# EAGLE design WaterCirculation (EAGLE 9.6.2)
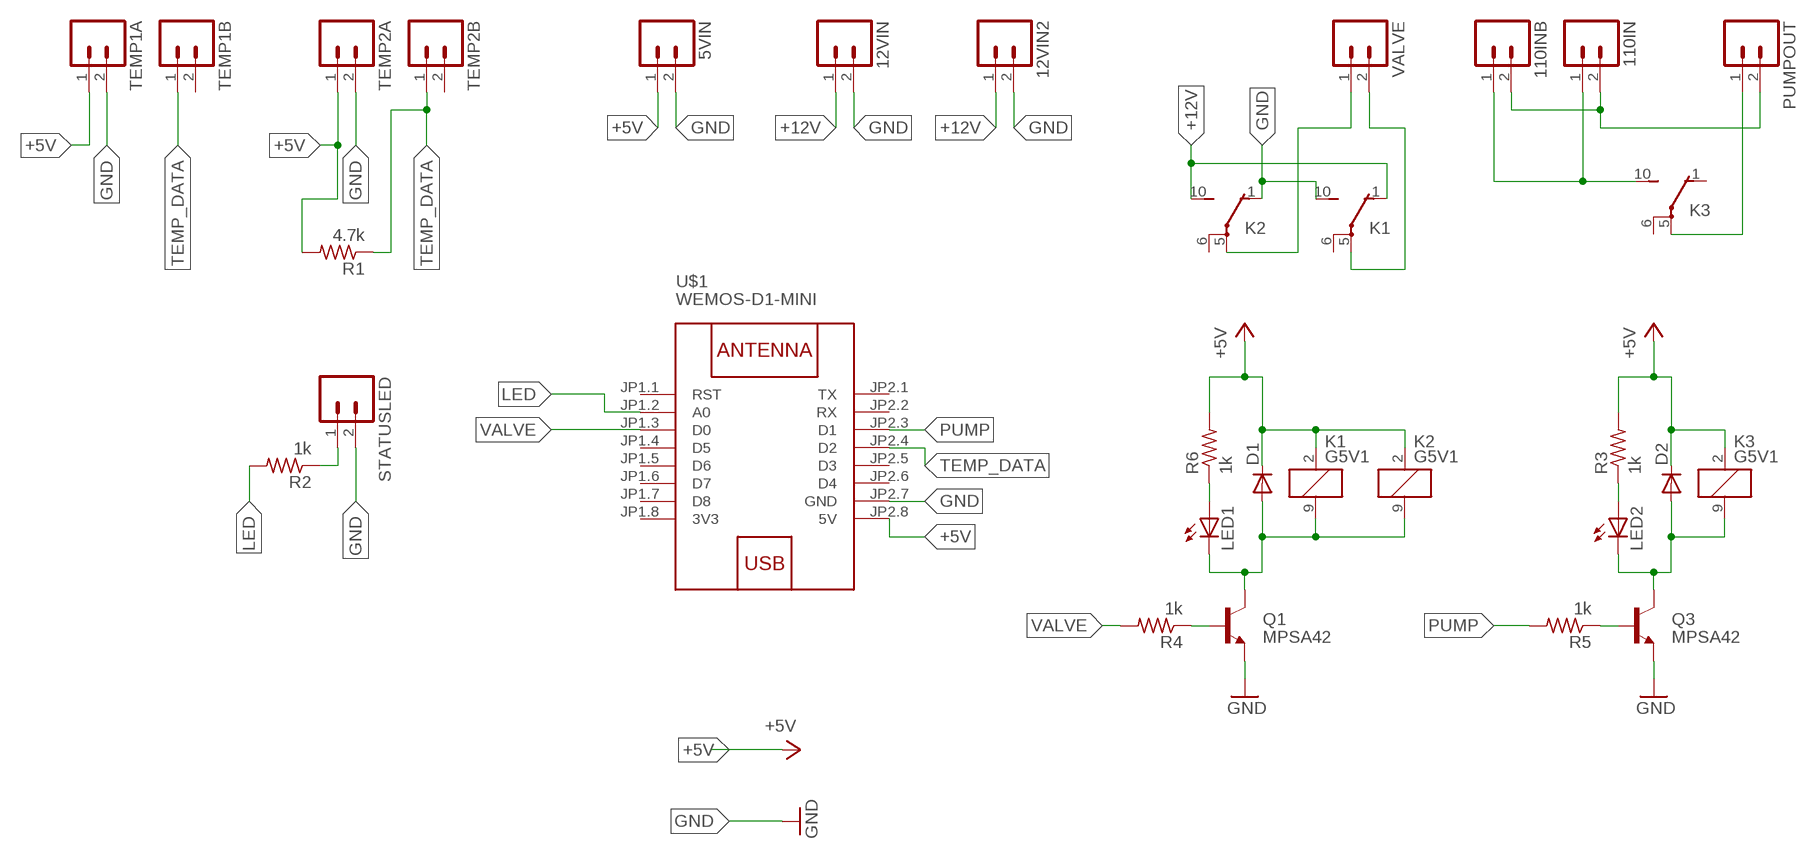
[diagram p0: schematic, sheet 1]

## Parts
5VIN  M023.5MM  [SCREWTERMINAL-3.5MM-2]
12VIN  M023.5MM  [SCREWTERMINAL-3.5MM-2]
12VIN2  M023.5MM  [SCREWTERMINAL-3.5MM-2]
110IN  M023.5MM  [SCREWTERMINAL-3.5MM-2]
110INB  M023.5MM  [SCREWTERMINAL-3.5MM-2]
D1  DIODE-SOD123  [SOD123]
D2  DIODE-SOD123  [SOD123]
K1  G5V1  [G5V1]
K2  G5V1  [G5V1]
K3  G5V1  [G5V1]
LED1  LEDCHIP-LED0805  [CHIP-LED0805]
LED2  LEDCHIP-LED0805  [CHIP-LED0805]
PUMPOUT  M023.5MM  [SCREWTERMINAL-3.5MM-2]
Q1  MPSA42  TRANSISTOR_NPNMPSA42  [SOT23-3]
Q3  MPSA42  TRANSISTOR_NPNMPSA42  [SOT23-3]
R1  4.7k  R-US_R0805  [R0805]
R2  1k  R-US_R0805  [R0805]
R3  1k  R-US_R0805  [R0805]
R4  1k  R-US_R0805  [R0805]
R5  1k  R-US_R0805  [R0805]
R6  1k  R-US_R0805  [R0805]
STATUSLED  M023.5MM  [SCREWTERMINAL-3.5MM-2]
TEMP1A  M023.5MM  [SCREWTERMINAL-3.5MM-2]
TEMP1B  M023.5MM  [SCREWTERMINAL-3.5MM-2]
TEMP2A  M023.5MM  [SCREWTERMINAL-3.5MM-2]
TEMP2B  M023.5MM  [SCREWTERMINAL-3.5MM-2]
U$1  WEMOS-D1-MINI  [WEMOS-D1-MINI]
VALVE  M023.5MM  [SCREWTERMINAL-3.5MM-2]

## Nets
+5V: 5VIN.1 D1.C D2.C K1.2 K2.2 K3.2 R1.2 R3.2 R6.2 TEMP1A.1 TEMP2A.1 U$1.JP2.8(5V)
+12V: 12VIN2.1 12VIN.1 K1.1(2:O) K2.10(2:S)
GND: 5VIN.2 12VIN2.2 12VIN.2 K1.10(2:S) K2.1(2:O) Q1.2(E) Q3.2(E) STATUSLED.2 TEMP1A.2 TEMP2A.2 U$1.JP2.7(GND)
LED: R2.2 U$1.JP1.2(A0)
N$1: Q1.1(B) R4.1
N$2: D1.A K1.9 K2.9 LED1.C Q1.3(C)
N$3: LED1.A R6.1
N$4: K2.5(2:P) VALVE.1
N$5: K1.5(2:P) VALVE.2
N$6: 110IN.2 110INB.2 PUMPOUT.2
N$7: D2.A K3.9 LED2.C Q3.3(C)
N$8: LED2.A R3.1
N$9: Q3.1(B) R5.1
N$10: 110IN.1 110INB.1 K3.10(2:S)
N$11: K3.5(2:P) PUMPOUT.1
N$12: R2.1 STATUSLED.1
PUMP: R5.2 U$1.JP2.3(D1)
TEMP_DATA: R1.1 TEMP1B.1 TEMP2B.1 U$1.JP2.4(D2)
VALVE: R4.2 U$1.JP1.3(D0)
Unconnected: K1.6(2:P) K2.6(2:P) K3.1(2:O) K3.6(2:P) TEMP1B.2 TEMP2B.2 U$1.JP1.1(RST) U$1.JP1.4(D5) U$1.JP1.5(D6) U$1.JP1.6(D7) U$1.JP1.7(D8) U$1.JP2.1(TX) U$1.JP2.2(RX) U$1.JP2.5(D3) U$1.JP2.6(D4)

## Power pins joined to a net without a drawn wire
3V3: U$1.JP1.8(3V3)

## Library data of the parts
5VIN 12VIN 12VIN2 110IN 110INB PUMPOUT STATUSLED TEMP1A TEMP1B TEMP2A TEMP2B VALVE = SparkFun-Connectors:M02: Standard 2-pin 0.1" header. Use with - straight break away headers ( PRT-00116) - right angle break away headers (PRT-00553) - swiss pins (PRT-00743) - machine pins (PRT-00117) - female headers (PRT-00115) Molex polarized connector foot print use with: PRT-08233 with associated crimp pins and housings. 2.54_SCREWTERM for use with PRT-10571. 3.5mm Screw Terminal footprints for PRT-08084 5mm Screw Terminal footprints for use with PRT-08432; PROD_ID: CONN-08399
D1 D2 = diode:DIODE-: DIODE
K1-K3 = relay:G5V1: RELAY 1 x switch, 0.5 A/125 V AC, 1 A/24 V DC , Omron
LED1 LED2 = led:LED: LED OSRAM: - CHIPLED LG R971, LG N971, LY N971, LG Q971, LY Q971, LO R971, LY R971 LH N974, LH R974 LS Q976, LO Q976, LY Q976 LO Q996 - Hyper CHIPLED LW Q18S LB Q993, LB Q99A, LB R99A - SideLED LS A670, LO A670, LY A670, LG A670, LP A670 LB A673, LV A673, LT A673, LW A673 LH A674 LY A675 LS A676, LA A676, LO A676, LY A676, LW A676 LS A679, LY A679, LG A679 - Hyper Micro SIDELED® LS Y876, LA Y876, LO Y876, LY Y876 LT Y87S - SmartLED LW L88C, LW L88S LB L89C, LB L89S, LG L890 LS L89K, LO L89K, LY L89K LS L896, LA L896, LO L896, LY L896 - TOPLED LS T670, LO T670, LY T670, LG T670, LP T670 LSG T670, LSP T670, LSY T670, LOP T670, LYG T670 LG T671, LOG T671, LSG T671 LB T673, LV T673, LT T673, LW T673 LH T674 LS T676, LA T676, LO T676, LY T676, LB T676, LH T676, LSB T676, LW T676 LB T67C, LV T67C, LT T67C, LS T67K, LO T67K, LY T67K, LW E67C LS E67B, LA E67B, LO E67B, LY E67B, LB E67C, LV E67C, LT E67C LW T67C LS T679, LY T679, LG T679 LS T770, LO T770, LY T770, LG T770, LP T770 LB T773, LV T773, LT T773, LW T773 LH T774 LS E675, LA E675, LY E675, LS T675 LS T776, LA T776, LO T776, LY T776, LB T776 LHGB T686 LT T68C, LB T68C - Hyper Mini TOPLED® LB M676 - Mini TOPLED Santana® LG M470 LS M47K, LO M47K, LY M47K Source: http://www.osram.convergy.de LUXEON: - LUMILED® LXK2-PW12-R00, LXK2-PW12-S00, LXK2-PW14-U00, LXK2-PW14-V00 LXK2-PM12-R00, LXK2-PM12-S00, LXK2-PM14-U00 LXK2-PE12-Q00, LXK2-PE12-R00, LXK2-PE12-S00, LXK2-PE14-T00, LXK2-PE14-U00 LXK2-PB12-K00, LXK2-PB12-L00, LXK2-PB12-M00, LXK2-PB14-N00, LXK2-PB14-P00, LXK2-PB14-Q00 LXK2-PR12-L00, LXK2-PR12-M00, LXK2-PR14-Q00, LXK2-PR14-R00 LXK2-PD12-Q00, LXK2-PD12-R00, LXK2-PD12-S00 LXK2-PH12-R00, LXK2-PH12-S00 LXK2-PL12-P00, LXK2-PL12-Q00, LXK2-PL12-R00 Source: www.luxeon.com KINGBRIGHT: KA-3528ASYC Source: www.kingbright.com
Q1 Q3 = SparkFun-DiscreteSemi:TRANSISTOR_NPN: Generic NPN BJT MMBT2222A - TRANS-08049 (SOT-23, 1A 40V) MPSA42 - TRANS-09116 (SOT-23, 500mA 300V) MMBT5088LT1G - TRANS-11160 (SOT-23, 50 mA 30V) BC547 - COM-08928 <http://www.sparkfun.com/products/8928> (TO-92 45V 100mA) (1.Collector 2.Base 3.Emitter) 2N3904 - COM-00521 <http://www.sparkfun.com/products/521> (TO-92 40V 200mA) (1.Emitter 2.Base 3.Collector) P2N2222A - COM-12852 <http://www.sparkfun.com/products/12852> (TO-92 40V 600mA) (1.Collector 2.Base 3.Emitter); PROD_ID: TRANS-09116
R1-R6 = resistor:R-US_: RESISTOR, American symbol
U$1 = diy-modules:WEMOS-D1-MINI: WEMOS D1 mini: Mini Wi-Fi Board based on ESP-8266 device More details can be found here: https://www.wemos.cc/product/d1-mini.html Click here to find device on ebay.com <http://www.ebay.com/sch/wemos+d1+mini+nodemcu>

## Board
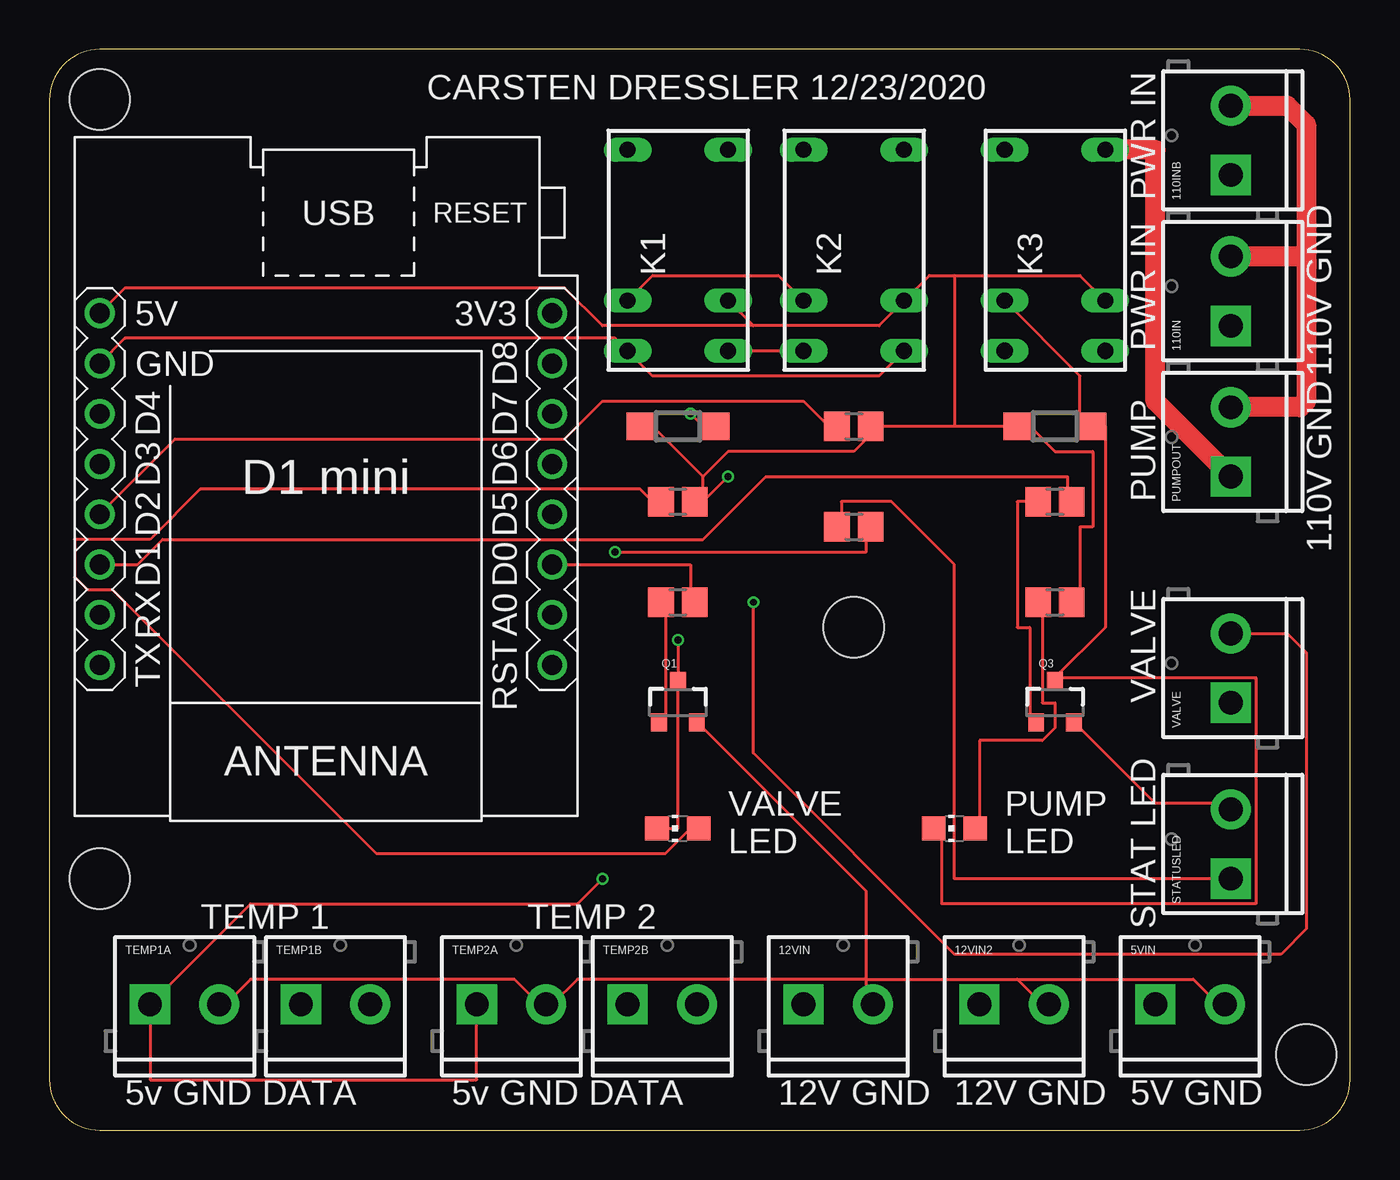
[diagram p1: board, top side]
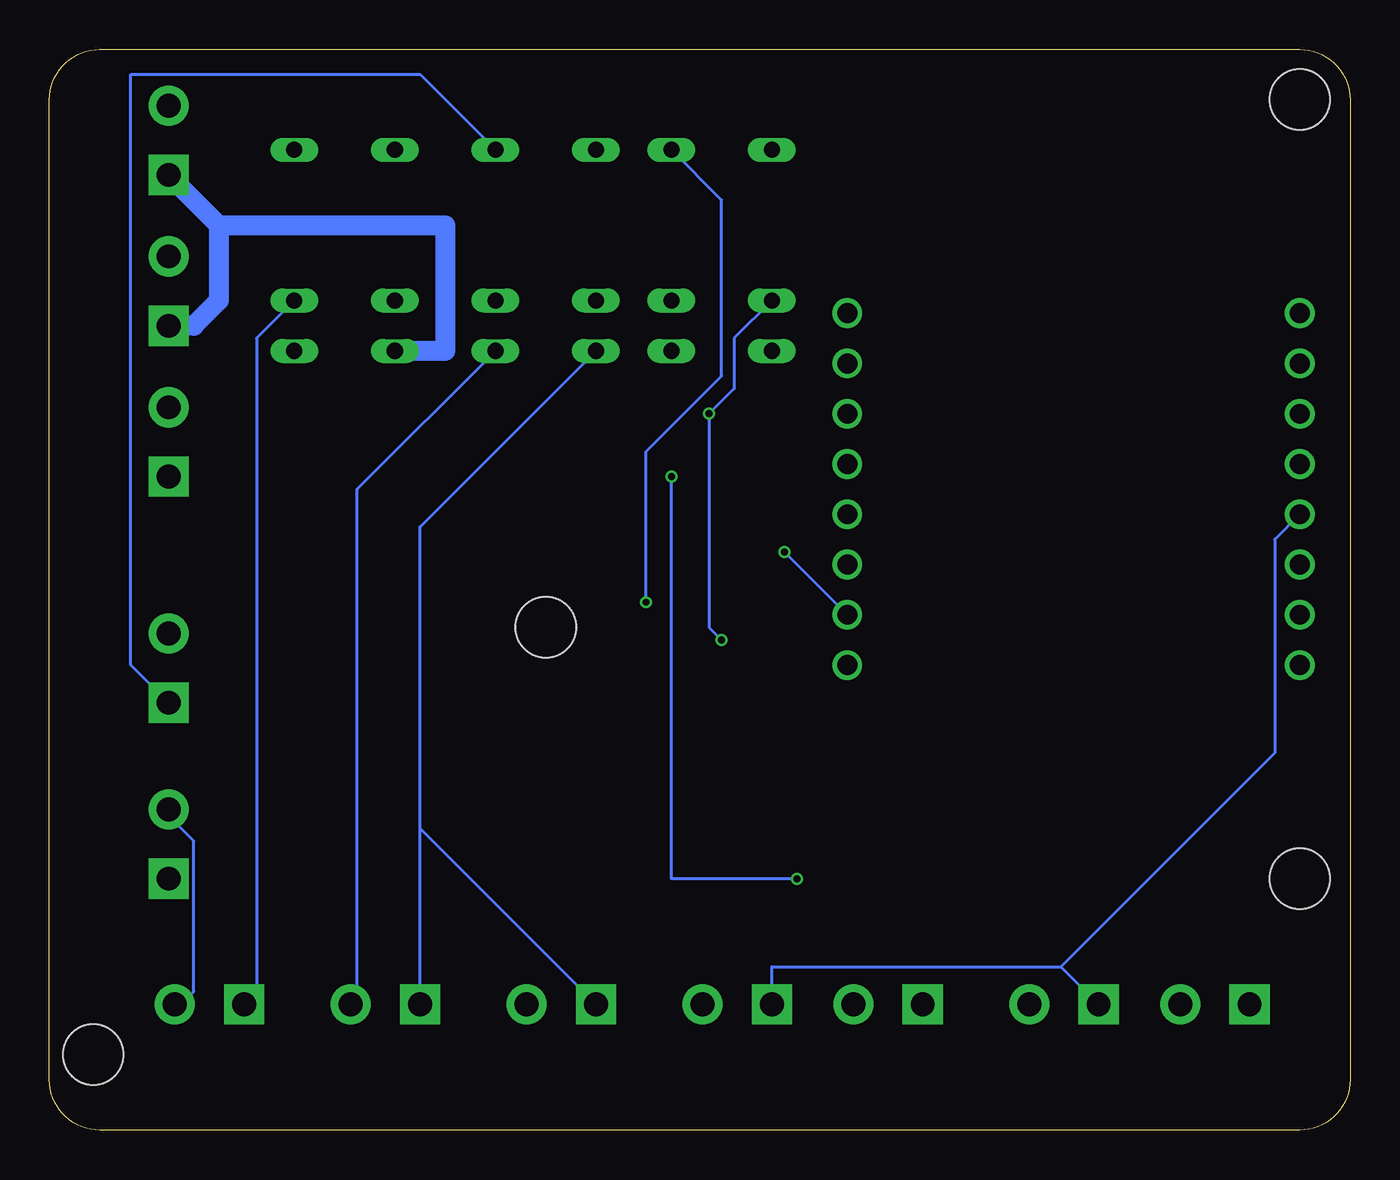
[diagram p2: board, bottom side, seen from below]

Size 65.71 x 54.6 mm. Coordinates in mm from the lower left corner, seen from the top.
Outline: 0,52.06 0,2.54 arc90 2.54,0 63.17,0 arc90 65.71,2.54 65.71,52.06 arc90 63.17,54.6 2.54,54.6 arc90 0,52.06
Copper layers (1*16): Top 0.035559375mm / dielectric 1.6mm / Bottom 0.035559375mm
Design rules "osh": minimum track width 6mil, minimum drill 10mil, track to track 6mil, track to pad 6mil, pad to pad 6mil, via to via 6mil, smd to smd 6mil, copper to edge 15mil, drill to drill 6mil, minimum pad ring 5mil, minimum via ring 5mil, stop-mask expansion 2.5mil, vias tented up to drill 0mil, thermal gap 10mil
Holes 3.05 mm at 2.54,52.07 40.64,25.4 63.5,3.81 2.54,12.7

### Footprints (pad centres in the part's own frame; a part is rotated, then mirrored left to right if it is on the bottom)
SCREWTERMINAL-3.5MM-2 = drill 1.2 pad 2.032 square: 1 0,0 | drill 1.2 pad 2.032: 2 3.5,0
SOD123 = smd 1.4 x 1.4: A 1.9,0; C -1.9,0
G5V1 = drill 0.813 long: 1 -5.08,-2.54; 2 -2.54,-2.54; 5 5.08,-2.54; 6 5.08,2.54; 9 -2.54,2.54; 10 -5.08,2.54
CHIP-LED0805 = smd 1.2 x 1.2: A 0,-1.05; C 0,1.05
SOT23-3 = smd 0.8 x 0.9: 1 -0.95,-1; 2 0.95,-1; 3 0,1.1
R0805 = smd 1.3 x 1.5: 1 -0.85,0; 2 0.85,0
WEMOS-D1-MINI = drill 1: JP1.1 -11.43,9.525; JP1.2 -11.43,6.985; JP1.3 -11.43,4.445; JP1.4 -11.43,1.905; JP1.5 -11.43,-0.635; JP1.6 -11.43,-3.175; JP1.7 -11.43,-5.715; JP1.8 -11.43,-8.255; JP2.1 11.43,9.525; JP2.2 11.43,6.985; JP2.3 11.43,4.445; JP2.4 11.43,1.905; JP2.5 11.43,-0.635; JP2.6 11.43,-3.175; JP2.7 11.43,-5.715; JP2.8 11.43,-8.255

### Placement (x,y rotation side)
5VIN  55.88,6.35 0 top
12VIN  38.1,6.35 0 top
12VIN2  46.99,6.35 0 top
110IN  59.69,40.64 90 top
110INB  59.69,48.26 90 top
D1  31.75,35.56 0 top
D2  50.8,35.56 0 top
K1  31.75,44.45 90 top
K2  40.64,44.45 90 top
K3  50.8,44.45 90 top
LED1  31.75,15.24 90 top
LED2  45.72,15.24 90 top
PUMPOUT  59.69,33.02 90 top
Q1  31.75,21.59 0 top
Q3  50.8,21.59 0 top
R1  40.64,35.56 0 top
R2  40.64,30.48 0 top
R3  50.8,26.67 0 top
R4  31.75,26.67 0 top
R5  50.8,31.75 0 top
R6  31.75,31.75 0 top
STATUSLED  59.69,12.7 90 top
TEMP1A  5.08,6.35 0 top
TEMP1B  12.7,6.35 0 top
TEMP2A  21.59,6.35 0 top
TEMP2B  29.21,6.35 0 top
U$1  13.97,33.02 180 top
VALVE  59.69,21.59 90 top

### Tracks (layer width: path | path; a pad name or v marks a point on that pad's centre or on a via)
+5V  (via drill 0.35)
  Top 0.152: 33.02,33.02 30.48,35.56 D1.C | 33.02,31.75 33.02,33.02 | 33.02,31.75 R6.2 | 41.91,35.56 45.72,35.56 | 45.72,35.56 D2.C 49.53,35.56 50.8,34.29 52.7,34.29 52.7,30.48 52.07,30.48 52.07,26.67 R3.2 | 33.02,33.02 34.29,34.29 40.64,34.29 41.91,35.56 | 41.91,35.56 R1.2 | 35.56,40.64 K1.2 | 35.56,40.64 41.91,40.64 K2.2 44.45,43.18 45.72,43.18 | K3.2 52.07,43.18 45.72,43.18 | U$1.JP2.8 3.81,42.55 26.04,42.55 27.94,40.64 35.56,40.64 | 45.72,43.18 45.72,35.56 | TEMP2A.1 21.59,2.54 5.08,2.54 TEMP1A.1 10.16,11.43 26.67,11.43 v27.94,12.7 | v34.29,33.02 33.02,31.75
  Bottom 0.152: 5VIN.1 55.24,6.99 55.24,40 K3.2 | v27.94,12.7 34.29,12.7 v34.29,33.02
+12V
  Top 0.152: K2.10 K1.1
  Bottom 0.152: K2.10 46.99,30.48 46.99,15.24 | 12VIN2.1 46.99,15.24 | 46.99,15.24 12VIN.1
GND
  Top 0.152: K2.1 41.91,38.1 30.48,38.1 K1.10 28.57,40 3.81,40 U$1.JP2.7 | TEMP1A.2 8.89,6.35 10.16,7.62 23.5,7.62 24.77,6.35 TEMP2A.2 25.4,6.35 26.67,7.62 41.27,7.62 | Q3.2 52.07,20.32 55.88,16.51 59.69,16.51 STATUSLED.2 | 41.27,7.62 41.27,6.35 12VIN.2 | 41.27,7.62 41.27,12.07 33.02,20.32 Q1.2 | 48.9,7.62 50.16,6.35 12VIN2.2 | 41.27,7.62 48.9,7.62 | 48.9,7.62 57.78,7.62 59.05,6.35 5VIN.2
  Bottom 0.152: STATUSLED.2 59.69,15.87 58.42,14.61 58.42,6.99 59.05,6.35 5VIN.2 | K2.1 50.16,32.39 50.16,6.35 12VIN2.2
LED  (via drill 0.35)
  Top 0.152: v28.57,29.21 41.27,29.21 41.27,30.48 R2.2
  Bottom 0.152: U$1.JP1.2 v28.57,29.21
N$1
  Top 0.152: Q1.1 31.11,20.96 31.11,26.67 R4.1
N$2  (via drill 0.35)
  Top 0.152: LED1.C 31.75,15.24 Q1.3 v31.75,24.76 | v32.38,36.19 33.02,35.56 D1.A | K2.9 36.83,43.18 30.48,43.18 K1.9
  Bottom 0.152: K1.9 31.11,40 31.11,37.46 v32.38,36.19 32.38,25.4 v31.75,24.76
N$3
  Top 0.152: LED1.A 32.38,15.24 31.11,13.97 16.51,13.97 3.17,27.3 1.91,27.3 1.27,27.94 1.27,29.85 5.08,29.85 7.62,32.39 29.84,32.39 30.48,31.75 R6.1
N$4
  Bottom 0.152: K2.5 46.99,53.34 61.59,53.34 61.59,23.5 VALVE.1
N$5  (via drill 0.35)
  Top 0.152: VALVE.2 62.54,25.09 63.5,24.13 63.5,10.16 62.23,8.89 45.72,8.89 35.56,19.05 v35.56,26.67
  Bottom 0.152: v35.56,26.67 35.56,34.29 31.75,38.1 31.75,46.99 K1.5
N$6
  Top 1.016: 110INB.2 62.54,51.76 63.5,50.8 63.5,44.45 | 63.5,44.45 63.19,44.14 110IN.2 | 63.5,44.45 63.5,36.83 63.19,36.52 PUMPOUT.2
N$7
  Top 0.152: 50.8,22.86 53.34,25.4 53.34,35.56 D2.A 52.07,35.56 52.07,38.1 K3.9 | 50.8,22.86 60.96,22.86 60.96,11.43 45.09,11.43 45.09,15.24 LED2.C | 50.8,22.86 Q3.3
N$8
  Top 0.152: LED2.A 46.99,15.24 46.99,19.68 50.16,19.68 50.8,20.32 50.8,21.59 50.16,21.59 50.16,26.67 R3.1
N$9
  Top 0.152: R5.1 48.9,31.75 48.9,25.4 49.53,25.4 49.53,20.96 Q3.1
N$10
  Bottom 1.016: 110INB.1 57.15,45.72 | 57.15,45.72 45.72,45.72 45.72,39.37 K3.10 | 57.15,45.72 57.15,41.91 58.42,40.64 110IN.1
N$11
  Top 1.016: PUMPOUT.1 55.88,36.83 55.88,49.53 K3.5
N$12
  Top 0.152: STATUSLED.1 45.72,12.7 45.72,28.57 42.55,31.75 40.01,31.75 40.01,30.48 R2.1
PUMP
  Top 0.152: U$1.JP2.3 4.45,28.57 5.71,29.85 33.02,29.85 36.2,33.02 51.44,33.02 51.44,31.75 R5.2
TEMP_DATA
  Top 0.152: U$1.JP2.4 6.35,34.92 26.04,34.92 27.94,36.83 38.1,36.83 39.37,35.56 R1.1
  Bottom 0.152: 14.61,8.25 TEMP1B.1 | 14.61,8.25 29.21,8.25 TEMP2B.1 | 14.61,8.25 3.81,19.05 3.81,29.85 U$1.JP2.4
VALVE
  Top 0.152: U$1.JP1.3 32.38,28.57 32.38,26.67 R4.2

### Text on the board
_tsilk: CARSTEN DRESSLER 12/23/2020 | PWR IN | PWR IN | 110V GND | PUMP | 110V GND | VALVE | VALVE / LED | PUMP / LED | TEMP 1 | TEMP 2 | STAT LED | 5v GND DATA | 5v GND DATA | 12V GND | 12V GND | 5V GND